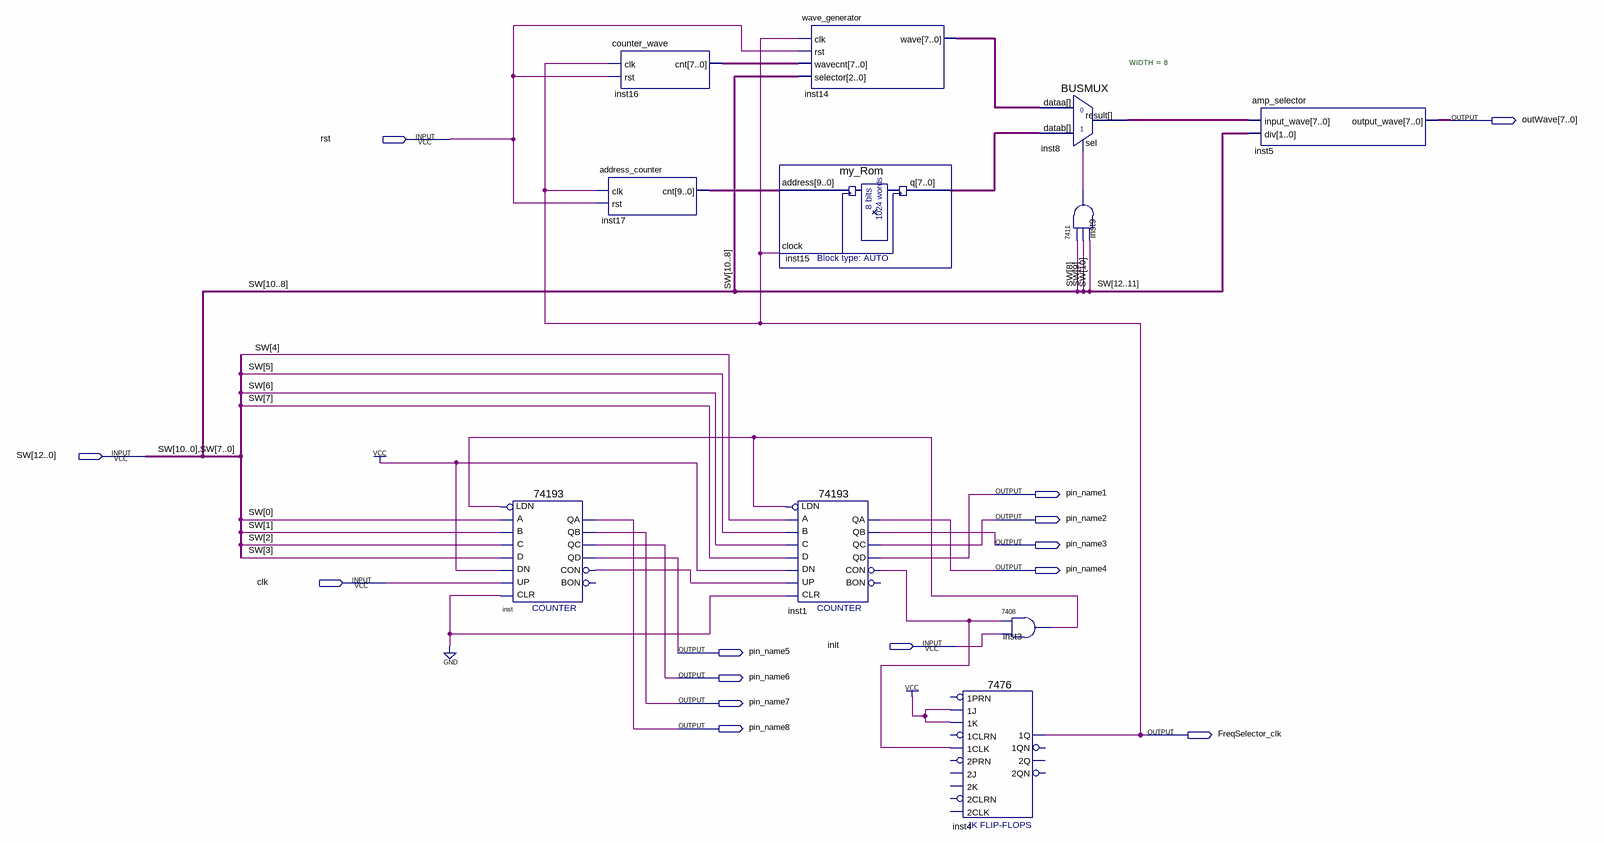
[diagram p0: schematic sheet]
// Quartus schematic Amplitude_Selector.bdf as structural Verilog: 11 symbols, 14 pins
module Amplitude_Selector (
  input  rst,
  input  [12:0] SW,
  input  clk,
  input  init,
  output [7:0] outWave,
  output pin_name1,
  output pin_name2,
  output pin_name3,
  output pin_name4,
  output pin_name5,
  output pin_name6,
  output pin_name7,
  output pin_name8,
  output FreqSelector_clk
);

  wire inst1_con, inst3_1, inst9_1, inst_con;
  wire [7:0] inst8_result, inst14_wave, inst15_q, inst16_cnt;
  wire [9:0] inst17_cnt;

  \74193  inst (
    .D(SW[3]), .C(SW[2]), .B(SW[1]), .A(SW[0]), .CLR(1'b0), .UP(clk), .DN(1'b1), .LDN(inst3_1),
    .QB(pin_name7), .QA(pin_name8), .CON(inst_con), .QD(pin_name5), .QC(pin_name6));  // open: BON
  counter_wave inst16 (.clk(FreqSelector_clk), .rst(rst), .cnt(inst16_cnt));
  address_counter inst17 (.clk(FreqSelector_clk), .rst(rst), .cnt(inst17_cnt));
  wave_generator inst14 (
    .clk(FreqSelector_clk), .rst(rst), .wavecnt(inst16_cnt), .selector(SW[10:8]), .wave(inst14_wave));
  my_Rom inst15 (.address(inst17_cnt), .clock(FreqSelector_clk), .q(inst15_q));
  \74193  inst1 (
    .D(SW[7]), .C(SW[6]), .B(SW[5]), .A(SW[4]), .CLR(1'b0), .UP(inst_con), .DN(1'b1), .LDN(inst3_1),
    .QB(pin_name3), .QA(pin_name4), .CON(inst1_con), .QD(pin_name1), .QC(pin_name2));  // open: BON
  \7476  inst4 (
    .\1J (1'b1), .\1K (1'b1), .\1CLK (inst1_con), .\1Q (FreqSelector_clk));  // open: 1PRN, 2PRN, 2J, 1CLRN, 2K, 2CLRN, 2CLK, 2QN, 2Q, 1QN
  \7408  inst3 (.\3 (init), .\2 (inst1_con), .\1 (inst3_1));
  BUSMUX #(.WIDTH(8)) inst8 (.datab(inst15_q), .sel(inst9_1), .dataa(inst14_wave), .result(inst8_result));
  \7411  inst9 (.\2 (SW[8]), .\3 (SW[9]), .\4 (SW[10]), .\1 (inst9_1));
  amp_selector inst5 (.input_wave(inst8_result), .div(SW[12:11]), .output_wave(outWave));
endmodule
